# Altium schematic sheet Tower Area.SchDoc
size A4
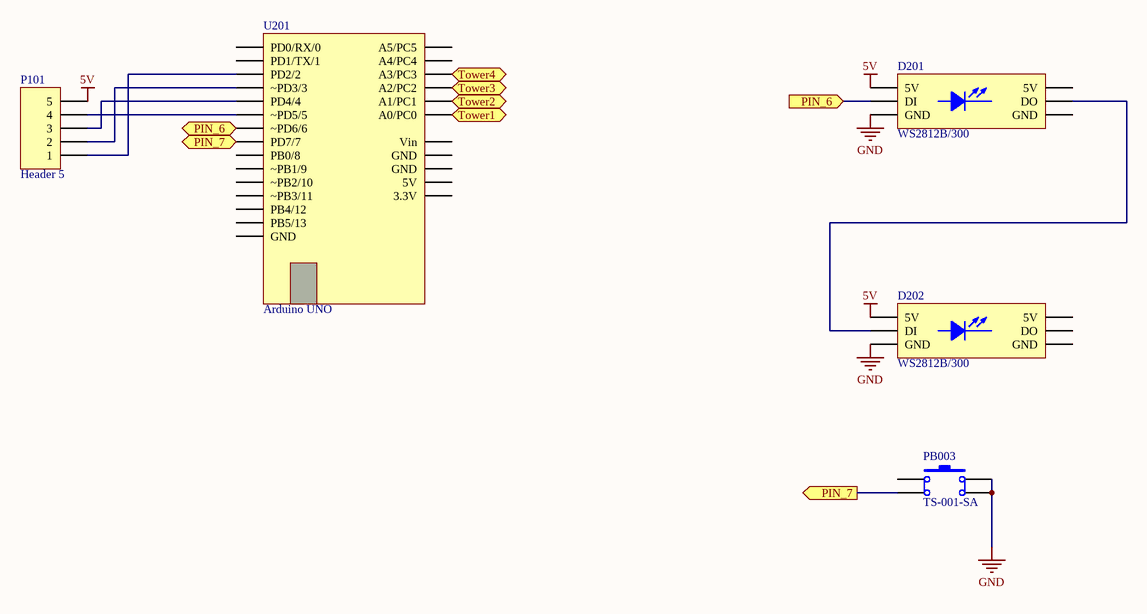
[diagram p0: Tower Area.SchDoc]

## Parts
D201  WS2812B/300
D202  WS2812B/300
P101  Header 5  [HDR1X5]
PB003  TS-001-SA
U201  Arduino UNO

## Ports
PIN_6 (in), PIN_6 (out), PIN_7 (in), PIN_7 (out), Tower1 (in), Tower2 (in), Tower3 (in), Tower4 (out)

## Nets
5V: D201.1(5V) D202.1(5V) P101.5
GND: D201.3(GND) D202.3(GND) PB003.2 PB003.4
PIN_6: D201.2(DI) U201.32(~PD6/6) ; port PIN_6
PIN_7: PB003.3 U201.33(PD7/7) ; port PIN_7
Tower1: U201.46(A0/PC0) ; port Tower1
Tower2: U201.45(A1/PC1) ; port Tower2
Tower3: U201.44(A2/PC2) ; port Tower3
Tower4: U201.43(A3/PC3) ; port Tower4
NetD201_5: D201.5(DO) D202.2(DI)
NetP101_1: P101.1 U201.28(PD2/2)
NetP101_2: P101.2 U201.29(~PD3/3)
NetP101_3: P101.3 U201.30(PD4/4)
NetP101_4: P101.4 U201.31(~PD5/5)

Not connected (* = marked no-connect by the designer): D201 4(5V) 6(GND); D202 4(5V) 5(DO) 6(GND); PB003 1; U201 26(PD0/RX/0) 27(PD1/TX/1) 34(PB0/8) 35(~PB1/9) 36(~PB2/10) 37(~PB3/11) 38(PB4/12) 39(PB5/13) 40(GND) 41(A5/PC5) 42(A4/PC4) 47(Vin) 48(GND) 49(GND) 50(5V) 51(3.3V)

## Library data of the parts
D201 D202 = WS2812B: LED strip; Voltage: 5V; Number: 300
P101 = Header 5: Header, 5-Pin; LatestRevisionDate: 17-Jul-2002; LatestRevisionNote: Re-released for DXP Platform.; Publisher: Altium Limited
PB003 = SW-PB: Push Buttom